# EasyEDA Pro project 主控G4.eprj

# Schematic Schematic1_2
Board Name: Board2功能多样; Create Date: 2025-11-01; Page Name: P1; Project Name: 主控G4; Schematic Name: Schematic1_2; Update Date: 2026-01-25; Company: 嘉立创EDA; Page Size: A4; Version: V1.0
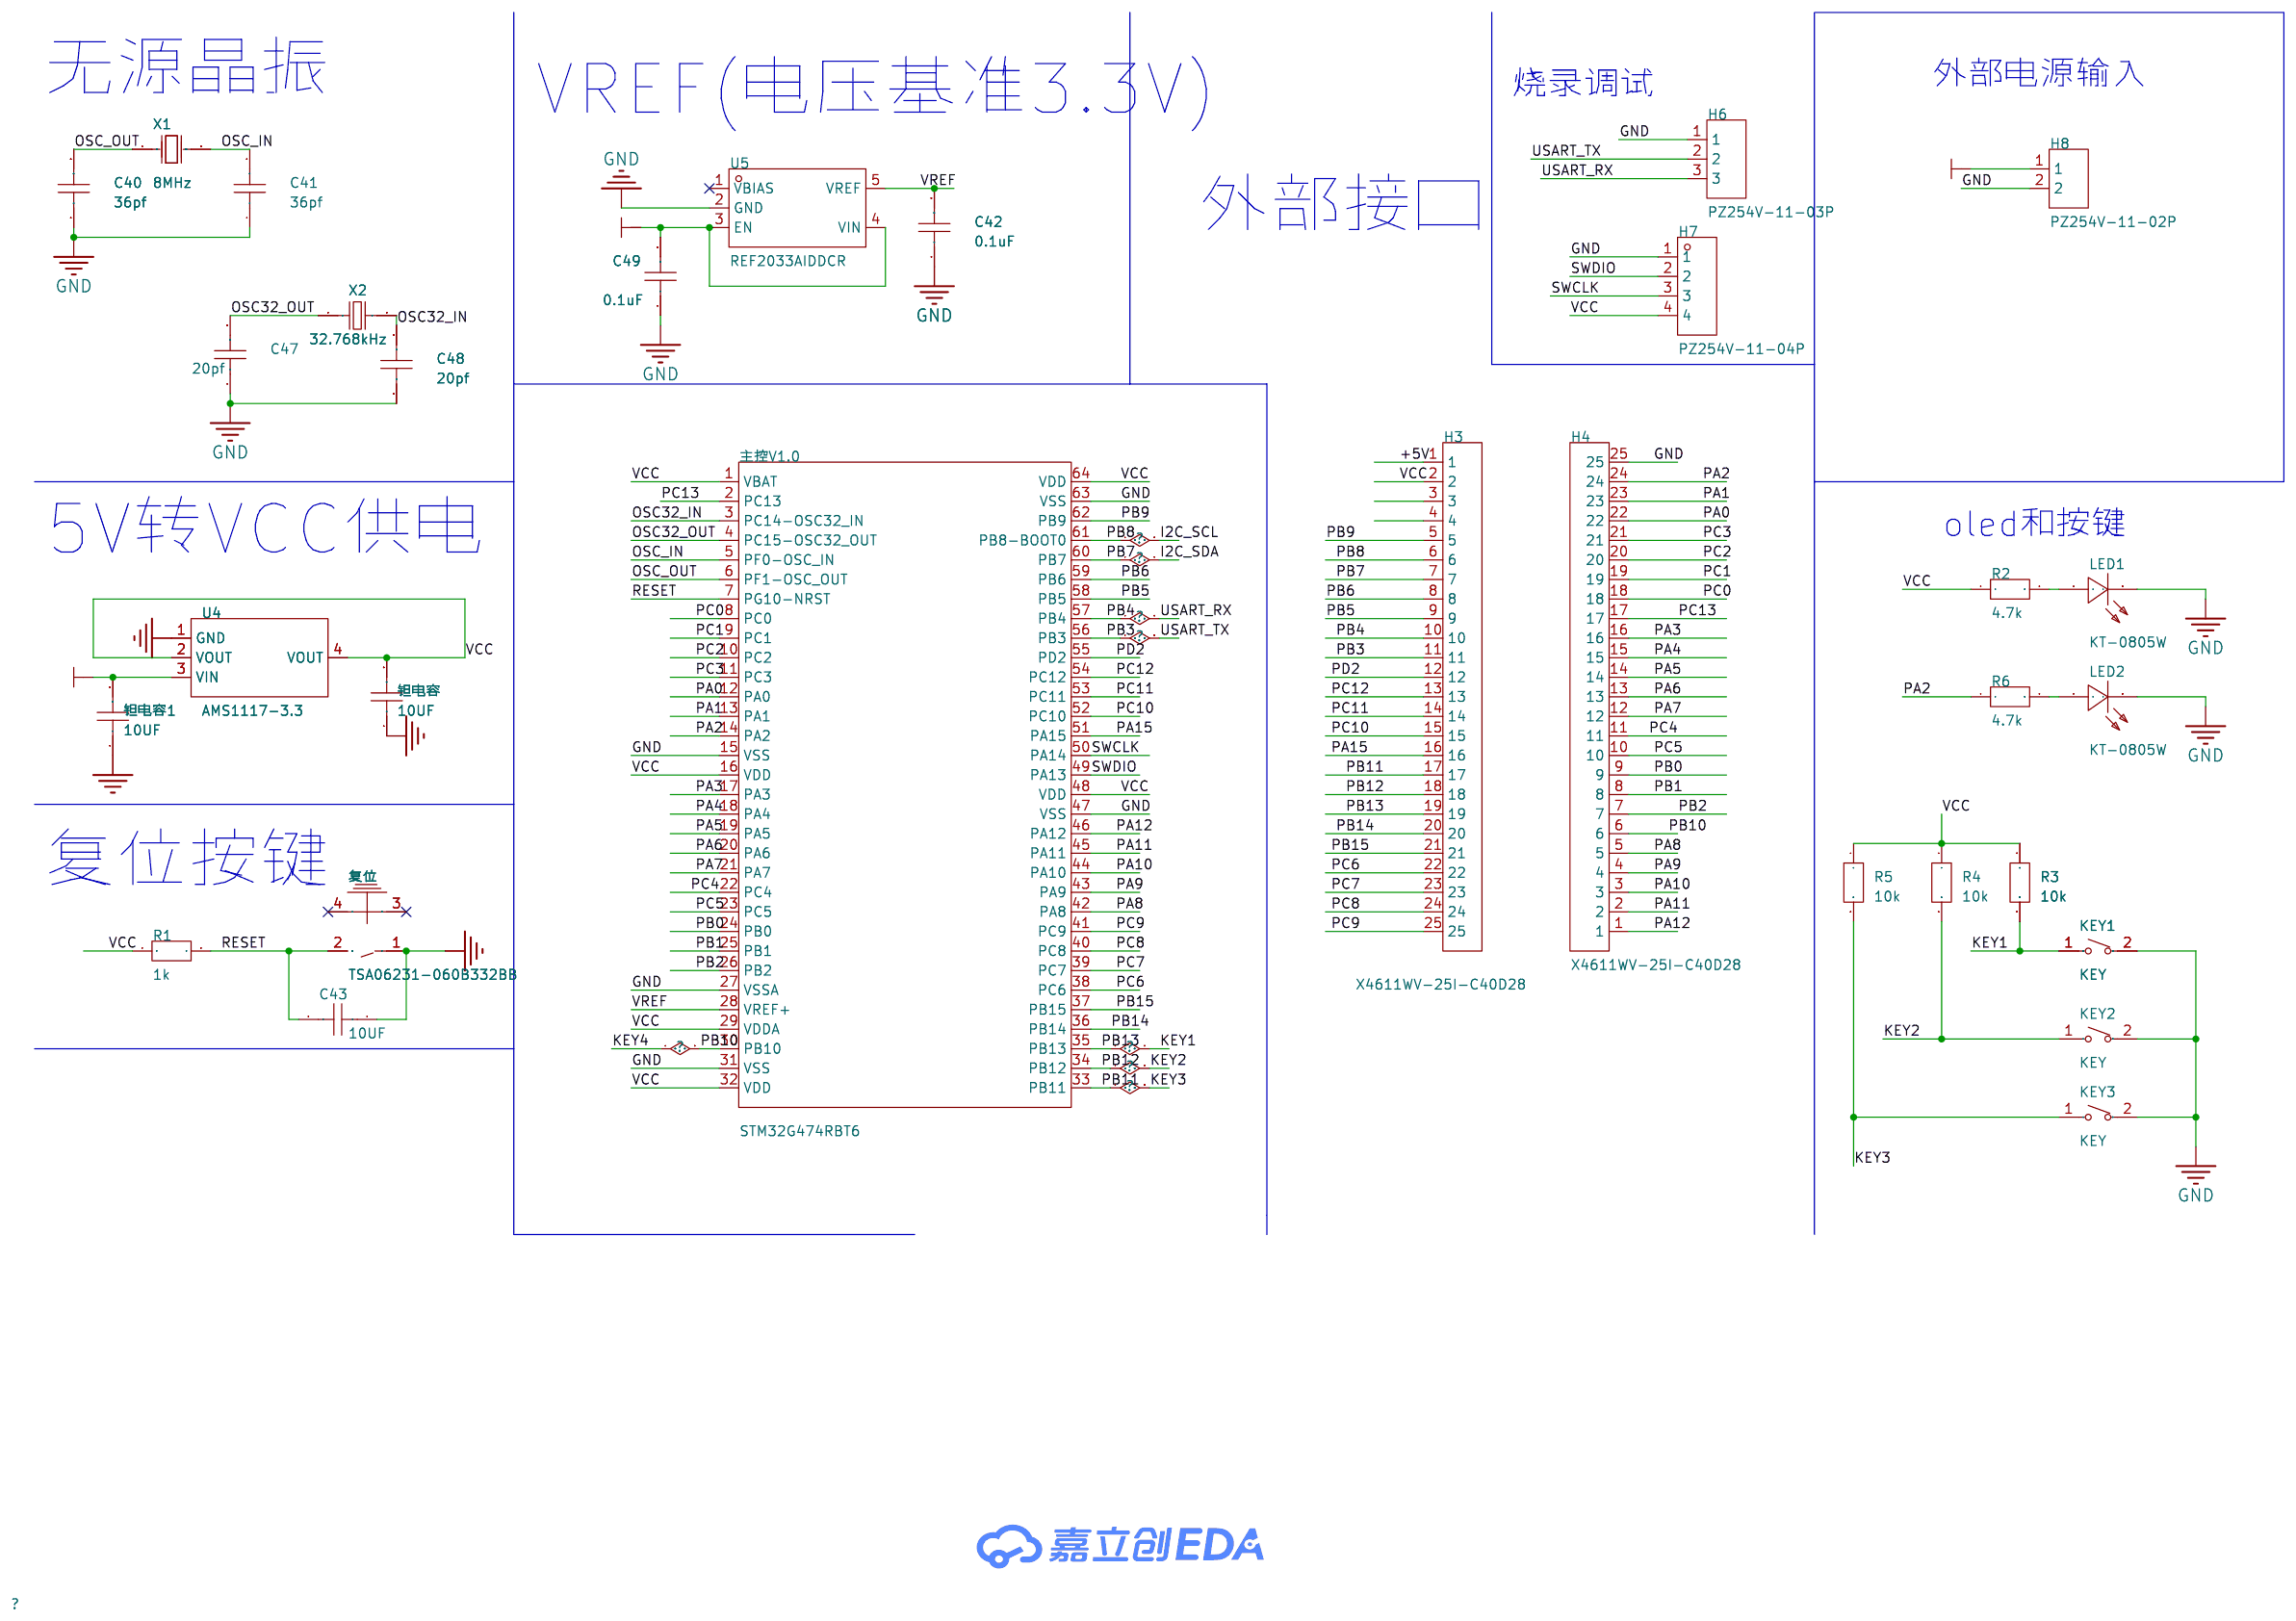
[diagram p0: schematic sheet]

## Parts
C40  36pf  [C0805]
C41  36pf  [C0805]
C42  0.1uF  [C0805]
C43  10UF  [C0805]
C47  20pf  [C0805]
C48  20pf  [C0805]
C49  0.1uF  [C0805]
H3  X4611WV-25I-C40D28  [HDR-TH_25P-P2.00-V-M]
H4  X4611WV-25I-C40D28  [HDR-TH_25P-P2.00-V-M]
H6  PZ254V-11-03P  [HDR-TH_3P-P2.54-V-M]
H7  PZ254V-11-04P  [HDR-TH_4P-P2.54-V-M]
H8  PZ254V-11-02P  [HDR-TH_2P-P2.54-V-M]
KEY1  KEY  [SW-SMD_L6.0-W3.7-LS8.0]
KEY2  KEY  [SW-SMD_L6.0-W3.7-LS8.0]
KEY3  KEY  [SW-SMD_L6.0-W3.7-LS8.0]
LED1  KT-0805W  [LED0805-R-RD]
LED2  KT-0805W  [LED0805-R-RD]
R1  1k  [R0603]
R2  4.7k  [R0805]
R3  10k  [R0805]
R4  10k  [R0805]
R5  10k  [R0805]
R6  4.7k  [R0805]
U4  AMS1117-3.3  [SOT-223-3_L6.5-W3.4-P2.30-LS7.0-BR]
U5  REF2033AIDDCR  [SOT-23-5_L3.0-W1.7-P0.95-LS2.8-BL]
X1  8MHz  [CRYSTAL-SMD_L5.0-W3.2]
X2  32.768kHz  [FC-135R_L3.2-W1.5]
主控V1.0  STM32G474RBT6  [LQFP-64_L10.0-W10.0-P0.50-LS12.0-BL]
复位  TSA06231-060B332BB  [SW-TH_TSA06231-060B332BB]
钽电容  10UF  [C0805]
钽电容1  10UF  [C0805]

## Library data of the parts
C40-C43 C47-C49 钽电容 钽电容1 = CC0805KRX7R9BB104: 容值:100nF;精度:±10%;额定电压:50V;材质(温度系数):X7R;; LCSC Part Name: 100nF ±10% 50V; Supplier Part: C49678; Manufacturer: YAGEO(国巨); Supplier Footprint: 0805; JLCPCB Part Class: 基础库; Datasheet: https://atta.szlcsc.com/upload/public/pdf/source/20180224/C181747_15194369449651363981.pdf; Supplier: LCSC; Tolerance: ±10%; Voltage Rated: 50V; Temperature Coefficient: X7R
H3 H4 = X4611WV-25I-C40D28: 插针结构:1x25P;间距:2mm;行距:2mm;圆针/方针:方针;排数:单排;总PIN位数:25P;额定电流:3A;额定电压:250V;配合针长度:-;塑高:2mm;端接针长度:-;触头材质:黄铜;触头镀层:金;工作温度:-40℃~+105℃;颜色:黑色;; LCSC Part Name: 1x25P 间距:2mm 方针; Supplier Part: C2882999; Manufacturer: XKB Connection(中国星坤); Supplier Footprint: 插件,P=2mm; JLCPCB Part Class: 扩展库; Supplier: LCSC; Pin Structure: 1x25P; Pitch: 2mm; Row Spacing: 2mm; Circluar Pins/Square Pins: 方针; Number of Rows: 单排; Number of Pins: 25P; Current Rating: 3A; Voltage Rating (Max): 250V; Insulation Height: 2mm; Contact Material: 黄铜; Contact Plating: 金; Operating Temperature: -40℃~+105℃; Color: 黑色
H6 = PZ254V-11-03P: LCSC Part Name: 1x3P 间距:2.54mm 方针 直插; Supplier Part: C2937625; Manufacturer: XFCN(兴飞); Supplier Footprint: 插件,P=2.54mm; JLCPCB Part Class: 扩展库; Datasheet: https://item.szlcsc.com/datasheet/PZ254V-11-03P/3293280.html; Supplier: LCSC; Pin Structure: 1x3P; Pitch: 2.54mm; Circluar Pins/Square Pins: 方针; Mounting Type: 直插; Number of Rows: 单排; Number of Pins: 3P; Current Rating: 3A; Voltage Rating (Max): 250V; Length of Mating Pin: 6mm; Insulation Height: 2.5mm; Length of End Connection Pin: 3mm; Operating Temperature: -40℃~+105℃; Color: 黑色
H7 = PZ254V-11-04P: LCSC Part Name: 1x4P 间距:2.54mm 方针 直插; Supplier Part: C2691448; Manufacturer: XFCN(兴飞); Supplier Footprint: 插件,P=2.54mm; JLCPCB Part Class: 扩展库; Datasheet: https://item.szlcsc.com/datasheet/PZ254V-11-04P/2801085.html; Supplier: LCSC; Pin Structure: 1x4P; Pitch: 2.54mm; Circluar Pins/Square Pins: 方针; Mounting Type: 直插; Number of Rows: 单排; Number of Pins: 4P; Current Rating: 3A; Voltage Rating (Max): 250V; Length of Mating Pin: 6mm; Insulation Height: 2.5mm; Length of End Connection Pin: 3mm; Operating Temperature: -40℃~+105℃; Color: 黑色
H8 = PZ254V-11-02P: 插针结构:1x2P;间距:2.54mm;行距:-;圆针/方针:方针;安装方式:直插;排数:单排;总PIN位数:2P;额定电流:-;额定电压:-;配合针长度:6mm;塑高:2.5mm;端接针长度:3mm;触头材质:黄铜;触头镀层:-;工作温度:-40℃~+105℃;颜色:黑色;; LCSC Part Name: 1x2P 间距:2.54mm 方针 直插; Supplier Part: C492401; Manufacturer: XFCN(兴飞); Supplier Footprint: 插件,P=2.54mm; JLCPCB Part Class: 扩展库; Datasheet: https://atta.szlcsc.com/upload/public/pdf/source/20200309/C492401_A812433581A9B211A7FFA413ADDFF0E5.pdf; Supplier: LCSC; Pin Structure: 1x2P; Pitch: 2.54mm; Circluar Pins/Square Pins: 方针; Mounting Type: 直插; Number of Rows: 单排; Number of Pins: 2P; Length of Mating Pin: 6mm; Insulation Height: 2.5mm; Length of End Connection Pin: 3mm; Contact Material: 黄铜; Operating Temperature: -40℃~+105℃; Color: 黑色
KEY1-KEY3 = KEY: Supplier Part: C9900023212; Supplier Footprint: SW-SMD-2P; JLCPCB Part Class: 扩展库; Supplier: LCSC
LED1 LED2 = KT-0805W: LCSC Part Name: 0805 白灯 高亮; Supplier Part: C34499; Manufacturer: KENTO; Supplier Footprint: 0805; JLCPCB Part Class: 基础库; Datasheet: https://atta.szlcsc.com/upload/public/pdf/source/20221124/DAA20402FFC1FB071B8B6797757426FE.pdf; Supplier: LCSC
R1 = CRCW0603348RFKEA: 电阻类型:厚膜电阻;阻值:348Ω;精度:±1%;功率:100mW;温度系数:±100ppm/℃;; LCSC Part Name: 厚膜电阻 348Ω ±1% 100mW; Supplier Part: C4074594; Manufacturer: VISHAY(威世); Supplier Footprint: 0603; JLCPCB Part Class: 扩展库; Datasheet: https://item.szlcsc.com/datasheet/CRCW0603348RFKEA/4643861.html; Supplier: LCSC; Type: 厚膜电阻; Tolerance: ±1%; Power(Watts): 100mW; Temperature Coefficient: ±100ppm/℃; Operating Temperature: -55℃~+155℃
R2-R6 = CRCW080510K0FKEB: LCSC Part Name: 停产 厚膜电阻 10kΩ ±1% 125mW; Supplier Part: C844194; Manufacturer: VISHAY(威世); Supplier Footprint: 0805; JLCPCB Part Class: 扩展库; Datasheet: https://atta.szlcsc.com/upload/public/pdf/source/20231213/E27ADD8137C82CFD375B974C2A3DE022.pdf; Supplier: LCSC; Type: 厚膜电阻; Tolerance: ±1%; Power(Watts): 125mW; Temperature Coefficient: ±100ppm/℃; Operating Temperature: -55℃~+155℃
U4 = AMS1117-3.3_C6186: 输出类型:固定;工作电压:-;输出电压:3.3V;输出电流:1A;电源纹波抑制比(PSRR):72dB@(120Hz);输出极性:正极;; LCSC Part Name: 输出3.3V 1A; Supplier Part: C6186; Manufacturer: AMS; Supplier Footprint: SOT-223; JLCPCB Part Class: 基础库; Datasheet: https://atta.szlcsc.com/upload/public/pdf/source/20180727/C6186_7A095716F0823C02F1997A905E26C086.pdf; Supplier: LCSC; Output Type: 固定; Output Voltage: 3.3V; Output Current: 1A; Power Supply Rejection Ratio (PSRR): 72dB@(120Hz); Voltage Dropout: 1.3V@(800mA); Features: 过流保护(OCP)；热保护(TSD); Output Configuration: 正极; Number of Outputs: 1
U5 = REF2033AIDDCR: 输出类型:固定;工作电压:3.32V~5.5V;输出电压:3.3V;输出电流:20mA;精度:±0.05%;; LCSC Part Name: 双输出参考电压源，适用于单电源系统; Supplier Part: C440747; Manufacturer: TI(德州仪器); Supplier Footprint: SOT-23-5; JLCPCB Part Class: 扩展库; Datasheet: https://www.ti.com/cn/lit/gpn/ref2033; Supplier: LCSC; Output Type: 固定; Voltage - Supply: 3.32V~5.5V; Output Voltage: 3.3V; Output Current: 20mA; Tolerance: ±0.05%; Temperature Coefficient: 8ppm/℃; Reference Type: 串联; Operating Temperature: -40℃~+125℃
X1 = X50328MSB2GI: 晶振类型:贴片晶振;频率:8MHz;常温频差:±10ppm;负载电容:20pF;频率稳定度:±20ppm;; LCSC Part Name: 8MHz ±10ppm 20pF; Supplier Part: C115962; Manufacturer: YXC(扬兴晶振); Supplier Footprint: SMD5032; JLCPCB Part Class: 基础库; Datasheet: https://atta.szlcsc.com/upload/public/pdf/source/20240329/44922B0AF7B60E58E9B66993B6077277.pdf; Supplier: LCSC; Type: 贴片晶振; Normal temperature Frequency Tolerance: ±10ppm; Load Capacitance: 20pF; Frequency Stability: ±20ppm; Operating Temperature: -40℃~+85℃
X2 = Q13FC1350000400: 晶振类型:贴片无源晶振;频率:32.768kHz;频率公差:±20ppm;频率稳定度:-;负载电容:12.5pF;等效串联电阻(ESR):70kΩ;工作温度:-40~+85;; LCSC Part Name: 32.768kHz ±20ppm 12.5pF; Supplier Part: C32346; Manufacturer: EPSON(爱普生); Supplier Footprint: SMD3215-2P; JLCPCB Part Class: Basic Part; Datasheet: https://atta.szlcsc.com/upload/public/pdf/source/20190108/C32346_746D6B07EAF90824457A96480007685F.pdf; Supplier: LCSC; Crystal Type: 贴片无源晶振; Frequency Tolerance: ±20ppm; Load Capacitance: 12.5pF; Equivalent Series Resistance (ESR): 70kΩ; Operating Temperature: -40~+85
主控V1.0 = STM32G474RBT6: CPU内核:ARM-M4;CPU最大主频:170MHz;应用领域:-;; LCSC Part Name: 带DSP和FPU的170MHz主流ARM Cortex-M4 MCU，具有128 KB Flash存储器、数学加速器、高分辨率定时器和高模拟电平集成; Supplier Part: C529413; Manufacturer: ST(意法半导体); Supplier Footprint: LQFP-64(10x10); JLCPCB Part Class: 扩展库; Datasheet: https://item.szlcsc.com/datasheet/STM32G474RBT6/549641.html; Supplier: LCSC; CPU Core: ARM-M4; CPU Maximum Speed: 170MHz; Program Storage Size: 128KB; Program Memory Type: FLASH; Number of I/O: 52; ADC (Bit): 12bit; DAC (Bit): 12bit; Voltage - Supply: 1.71V~3.6V
复位 = TSA06231-060B332BB: 卧式插式、3.2座、180gf不锈钢、Fe缺口支架、PA66红柄; LCSC Part Name: 轻触开关; Supplier Part: C42435078; Manufacturer: Khon(康宏电子); Supplier Footprint: 弯插-4P,7.4x6.2mm; Datasheet: https://atta.szlcsc.com/upload/public/pdf/source/20250107/79642270F222B0186377B45340056112.pdf; Supplier: LCSC

## Nets
+5V: C49.2 H3.1 H8.1 U4.3(VIN) U5.3(EN) U5.4(VIN) 钽电容1.2
GND: C40.1 C41.1 C42.1 C43.1 C47.1 C48.1 C49.1 H4.25 H6.1 H7.1 H8.2 KEY1.2 KEY2.2 KEY3.2 LED1.2(K) LED2.2(K) U4.1(GND) U5.2(GND) 主控V1.0.15(VSS) 主控V1.0.27(VSSA) 主控V1.0.31(VSS) 主控V1.0.47(VSS) 主控V1.0.63(VSS) 复位.1 钽电容.1 钽电容1.1
VCC: H3.2 H7.4 R1.1 R2.1 R3.1 R4.1 R5.1 U4.2(VOUT) U4.4(VOUT) 主控V1.0.1(VBAT) 主控V1.0.16(VDD) 主控V1.0.29(VDDA) 主控V1.0.32(VDD) 主控V1.0.48(VDD) 主控V1.0.64(VDD) 钽电容.2
I2C_SCL: H3.6 主控V1.0.61(PB8-BOOT0)
I2C_SDA: H3.7 主控V1.0.60(PB7)
KEY1: H3.19 KEY1.1 R3.2 主控V1.0.35(PB13)
KEY2: H3.18 KEY2.1 R4.2 主控V1.0.34(PB12)
KEY3: H3.17 KEY3.1 R5.2 主控V1.0.33(PB11)
KEY4: H4.6 主控V1.0.30(PB10)
OSC32_IN: C48.2 X2.2 主控V1.0.3(PC14-OSC32_IN)
OSC32_OUT: C47.2 X2.1 主控V1.0.4(PC15-OSC32_OUT)
OSC_IN: C41.2 X1.2(OSC2) 主控V1.0.5(PF0-OSC_IN)
OSC_OUT: C40.2 X1.1(OSC1) 主控V1.0.6(PF1-OSC_OUT)
PA0: H4.22 主控V1.0.12(PA0)
PA1: H4.23 主控V1.0.13(PA1)
PA2: H4.24 R6.1 主控V1.0.14(PA2)
PA3: H4.16 主控V1.0.17(PA3)
PA4: H4.15 主控V1.0.18(PA4)
PA5: H4.14 主控V1.0.19(PA5)
PA6: H4.13 主控V1.0.20(PA6)
PA7: H4.12 主控V1.0.21(PA7)
PA8: H4.5 主控V1.0.42(PA8)
PA9: H4.4 主控V1.0.43(PA9)
PA10: H4.3 主控V1.0.44(PA10)
PA11: H4.2 主控V1.0.45(PA11)
PA12: H4.1 主控V1.0.46(PA12)
PA15: H3.16 主控V1.0.51(PA15)
PB0: H4.9 主控V1.0.24(PB0)
PB1: H4.8 主控V1.0.25(PB1)
PB2: H4.7 主控V1.0.26(PB2)
PB3: H3.11 H6.2 主控V1.0.56(PB3)
PB4: H3.10 H6.3 主控V1.0.57(PB4)
PB5: H3.9 主控V1.0.58(PB5)
PB6: H3.8 主控V1.0.59(PB6)
PB9: H3.5 主控V1.0.62(PB9)
PB14: H3.20 主控V1.0.36(PB14)
PB15: H3.21 主控V1.0.37(PB15)
PC0: H4.18 主控V1.0.8(PC0)
PC1: H4.19 主控V1.0.9(PC1)
PC2: H4.20 主控V1.0.10(PC2)
PC3: H4.21 主控V1.0.11(PC3)
PC4: H4.11 主控V1.0.22(PC4)
PC5: H4.10 主控V1.0.23(PC5)
PC6: H3.22 主控V1.0.38(PC6)
PC7: H3.23 主控V1.0.39(PC7)
PC8: H3.24 主控V1.0.40(PC8)
PC9: H3.25 主控V1.0.41(PC9)
PC10: H3.15 主控V1.0.52(PC10)
PC11: H3.14 主控V1.0.53(PC11)
PC12: H3.13 主控V1.0.54(PC12)
PC13: H4.17 主控V1.0.2(PC13)
PD2: H3.12 主控V1.0.55(PD2)
RESET: C43.2 R1.2 主控V1.0.7(PG10-NRST) 复位.2
SWCLK: H7.3 主控V1.0.50(PA14)
SWDIO: H7.2 主控V1.0.49(PA13)
VREF: C42.2 U5.5(VREF) 主控V1.0.28(VREF+)
$1N19272: LED1.1(A) R2.2
$1N19808: LED2.1(A) R6.2

Not connected (* = marked no-connect by the designer): H3 3 4; U5 1(VBIAS)*; 复位 3* 4*

## Notes on the sheet
- 外部电源输入
- 无源晶振
- 烧录调试
- VREF(电压基准3.3V)
- 外部接口
- oled和按键
- 5V转VCC供电
- 复位按键

# Board PCB1_2
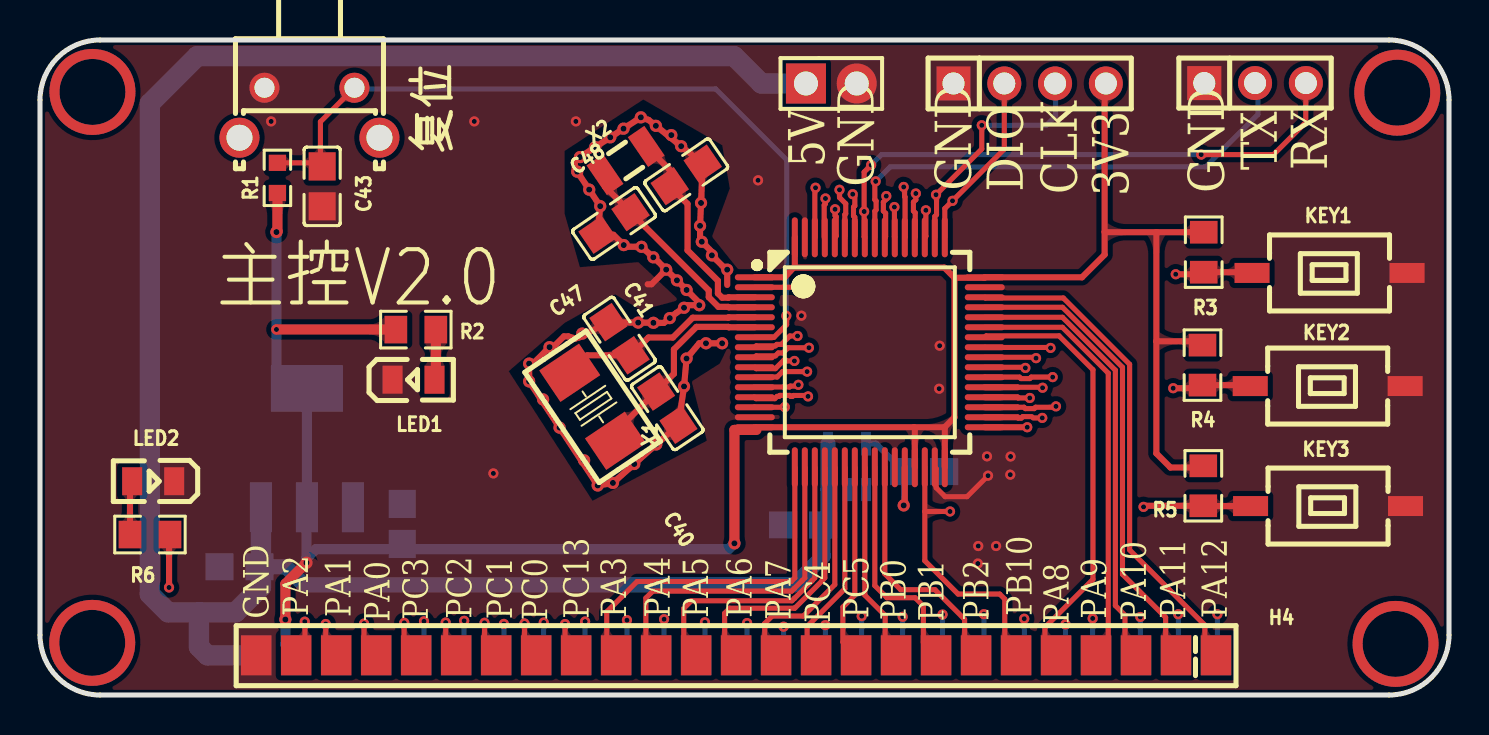
[diagram p1: board, top side]
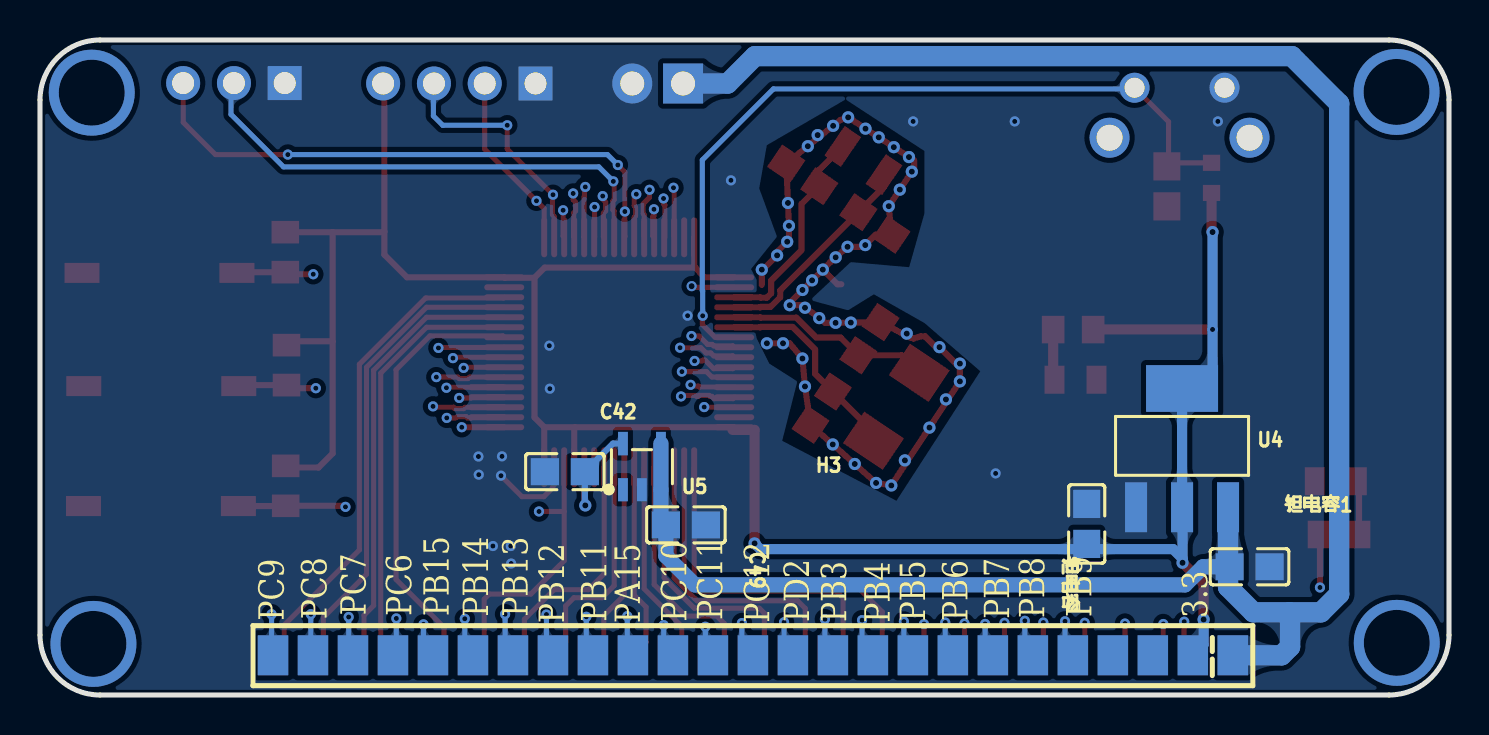
[diagram p2: board, bottom side, seen from below]

Outline 70.46 x 32.77 mm; copper layers: Top Layer, Inner1, Inner2, Bottom Layer. Coordinates in mm from the lower left corner of the outline.
Outline path: 0,29.77 0,3 arc(0.88,0.88) 3,0 67.46,0 arc(69.59,0.88) 70.46,3 70.46,29.77 arc(69.59,31.89) 67.46,32.77 3,32.77 arc(0.88,31.89) 0,29.77
Stack: Top Layer 0.035mm 外层铜厚1oz / Dielectric1 0.2104mm 7628 RC49% 8.6mil / Inner1 0.0152mm 内层铜厚 / Dielectric2 1.065mm 1.1mm H/HOZ Copper / Inner2 0.0152mm 内层铜厚 / Dielectric3 0.2104mm 7628 RC49% 8.6mil / Bottom Layer 0.035mm 外层铜厚1oz

## Design rules (mm)
net OSC_OUT: DP1
net OSC_IN: DP1
net OSC32_OUT: DP2
net OSC32_IN: DP2
template: 自定义配置
spacing copperThickness1oz (default): track to track 0.102, other pairs 0.152 to 0.3
spacing copperThickness2oz: track to track 0.203, other pairs 0.152 to 0.3
track width copperThickness1oz (default): min 0.127, default 0.254, max 2.54
track width copperThickness2oz: min 0.203, default 0.254, max 2.54
differential pair differentialPair (default): width min 0.127, default 0.254, max 2.54; gap min 0.152, default 0.152
via viaSize (default): diameter min 0.5, default 0.508, max 5.08; hole min 0.025, default 0.254, max 4

## Placement (name value [footprint] x y rotation side)
C40  36pf  [C0805]  31.37 14.35 124 top
C41  36pf  [C0805]  28.98 17.82 304 top
C42  0.1uF  [C0805]  44.21 11.17 180 bottom
C43  10UF  [C0805]  14.11 25.44 90 top
C47  20pf  [C0805]  28.71 23.59 34.4 top
C48  20pf  [C0805]  32.32 26.02 214.4 top
C49  0.1uF  [C0805]  38.16 8.51 0 bottom
H3  X4611WV-25I-C40D28  [HDR-TH_25P-P2.00-V-M#2]  34.81 1.99 0 bottom
H4  X4611WV-25I-C40D28  [HDR-TH_25P-P2.00-V-M]  34.65 1.54 180 top
H6  PZ254V-11-03P  [HDR-TH_3P-P2.54-V-M]  60.77 30.61 0 top
H7  PZ254V-11-04P  [HDR-TH_4P-P2.54-V-M]  49.49 30.59 0 top
H8  PZ254V-11-02P  [HDR-TH_2P-P2.54-V-M]  39.57 30.59 0 top
KEY1  KEY  [SW-SMD_L6.0-W3.7-LS8.0]  64.49 21.11 0 top
KEY2  KEY  [SW-SMD_L6.0-W3.7-LS8.0]  64.4 15.45 0 top
KEY3  KEY  [SW-SMD_L6.0-W3.7-LS8.0]  64.42 9.45 0 top
LED1  KT-0805W  [LED0805-R-RD]  18.68 15.77 0 top
LED2  KT-0805W  [LED0805-R-RD]  5.66 10.69 180 top
R1  1k  [R0603]  11.87 25.87 90 top
R2  4.7k  [R0805]  18.8 18.28 0 top
R3  10k  [R0805]  58.2 22.15 270 top
R4  10k  [R0805]  58.14 16.5 270 top
R5  10k  [R0805]  58.18 10.47 270 top
R6  4.7k  [R0805]  5.5 8.03 180 top
U4  AMS1117-3.3  [SOT-223-3_L6.5-W3.4-P2.30-LS7.0-BR]  13.35 12.36 270 bottom
U5  REF2033AIDDCR  [SOT-23-5_L3.0-W1.7-P0.95-LS2.8-BL]  40.36 11.42 180 bottom
X1  8MHz  [CRYSTAL-SMD_L5.0-W3.2]  27.64 14.42 124 top
X2  32.768kHz  [FC-135R_L3.2-W1.5]  29.29 26.74 34.4 top
主控V1.0  STM32G474RBT6  [LQFP-64_L10.0-W10.0-P0.50-LS12.0-BL]  41.5 17.14 270 top
复位  TSA06231-060B332BB  [SW-TH_TSA06231-060B332BB]  13.48 29.13 0 top
钽电容  10UF  [C0805]  18.12 8.56 270 bottom
钽电容1  10UF  [C0805]  9.98 6.41 0 bottom

## Footprints (pads in the part's own frame, mm; a bottom-side part is the same pattern mirrored in y, then rotated)
C0805
  rect 1.41x1.35 smd: 1(-1,0) 2(1,0)
CRYSTAL-SMD_L5.0-W3.2
  rect 1.9x2.4 smd: 1(-2.05,0) 2(2.05,0)
FC-135R_L3.2-W1.5
  rect 1.001x1.801 smd: 1(-1.25,0) 2(1.25,0)
HDR-TH_2P-P2.54-V-M
  rect 2x2 hole 1.2: 1(-1.27,0)
  round 2 hole 1.2: 2(1.27,0)
HDR-TH_3P-P2.54-V-M
  rect 1.7x1.7 hole 1.1: 1(-2.54,0)
  round 1.7 hole 1.1: 2(0,0) 3(2.54,0)
HDR-TH_4P-P2.54-V-M
  rect 1.7x1.7 hole 1.1: 1(-3.81,0)
  round 1.7 hole 1.1: 2(-1.27,0) 3(1.27,0) 4(3.81,0)
HDR-TH_25P-P2.00-V-M
  rect 1.524x2 smd: 1(-24.165,-0.445) 2(-22.165,-0.445) 3(-20.165,-0.445) 4(-18.165,-0.445) 5(-16.165,-0.445) 6(-14.165,-0.445) 7(-12.165,-0.445) 8(-10.165,-0.445) 9(-8.165,-0.445) 10(-6.165,-0.445) 11(-4.165,-0.445) 12(-2.165,-0.445) 13(-0.165,-0.445) 14(1.835,-0.445) 15(3.835,-0.445) 16(5.835,-0.445) 17(7.835,-0.445) 18(9.835,-0.445) 19(11.835,-0.445) 20(13.835,-0.445) 21(15.835,-0.445) 22(17.835,-0.445) 23(19.835,-0.445) 24(21.835,-0.445) 25(23.835,-0.445)
HDR-TH_25P-P2.00-V-M#2
  rect 1.524x2 smd: 1(-24,0) 2(-22,0) 3(-20,0) 4(-18,0) 5(-16,0) 6(-14,0) 7(-12,0) 8(-10,0) 9(-8,0) 10(-6,0) 11(-4,0) 12(-2,0) 13(0,0) 14(2,0) 15(4,0) 16(6,0) 17(8,0) 18(10,0) 19(12,0) 20(14,0) 21(16,0) 22(18,0) 23(20,0) 24(22,0) 25(24,0)
LED0805-R-RD
  rect 1x1.399 smd: 1(1.05,0) 2(-1.05,0)
LQFP-64_L10.0-W10.0-P0.50-LS12.0-BL
  oval 0.3x2 smd: 1(-3.75,-5.75) 2(-3.25,-5.75) 3(-2.75,-5.75) 4(-2.25,-5.75) 5(-1.75,-5.75) 6(-1.25,-5.75) 7(-0.75,-5.75) 8(-0.25,-5.75) 9(0.25,-5.75) 10(0.75,-5.75) 11(1.25,-5.75) 12(1.75,-5.75) 13(2.25,-5.75) 14(2.75,-5.75) 15(3.25,-5.75) 16(3.75,-5.75) 33(3.75,5.75) 34(3.25,5.75) 35(2.75,5.75) 36(2.25,5.75) 37(1.75,5.75) 38(1.25,5.75) 39(0.75,5.75) 40(0.25,5.75) 41(-0.25,5.75) 42(-0.75,5.75) 43(-1.25,5.75) 44(-1.75,5.75) 45(-2.25,5.75) 46(-2.75,5.75) 47(-3.25,5.75) 48(-3.75,5.75)
  oval 2x0.3 smd: 17(5.75,-3.75) 18(5.75,-3.25) 19(5.75,-2.75) 20(5.75,-2.25) 21(5.75,-1.75) 22(5.75,-1.25) 23(5.75,-0.75) 24(5.75,-0.25) 25(5.75,0.25) 26(5.75,0.75) 27(5.75,1.25) 28(5.75,1.75) 29(5.75,2.25) 30(5.75,2.75) 31(5.75,3.25) 32(5.75,3.75) 49(-5.75,3.75) 50(-5.75,3.25) 51(-5.75,2.75) 52(-5.75,2.25) 53(-5.75,1.75) 54(-5.75,1.25) 55(-5.75,0.75) 56(-5.75,0.25) 57(-5.75,-0.25) 58(-5.75,-0.75) 59(-5.75,-1.25) 60(-5.75,-1.75) 61(-5.75,-2.25) 62(-5.75,-2.75) 63(-5.75,-3.25) 64(-5.75,-3.75)
R0603
  rect 0.806x0.864 smd: 1(-0.753,0) 2(0.753,0)
R0805
  rect 1.133x1.377 smd: 1(-1,0) 2(1,0)
SOT-23-5_L3.0-W1.7-P0.95-LS2.8-BL
  rect 0.49x1.157 smd: 1(-0.95,-1.153) 2(0,-1.153) 3(0.95,-1.153)
  rect 0.49x1.175 smd: 4(0.95,1.153) 5(-0.95,1.153)
SOT-223-3_L6.5-W3.4-P2.30-LS7.0-BR
  rect 2.5x1.1 smd: 1(2.97,-2.3) 2(2.97,0) 3(2.97,2.3)
  rect 2.34x3.6 smd: 4(-2.97,0)
SW-SMD_L6.0-W3.7-LS8.0
  rect 1.75x1 smd: 1(-3.875,0) 2(3.875,0)
SW-TH_TSA06231-060B332BB
  round 1.5 hole 1: 1(-2.25,1.25) 2(2.25,1.25)
  round 2 hole 1.3: 3(-3.5,-1.25) 4(3.5,-1.25)

## Nets
As in the schematic.

Pads without a net: U5 1; 复位 3 4

## Via types
v1: diameter 4.3, hole 3.3, Top Layer to Bottom Layer, 4 vias
v2: diameter 0.61, hole 0.305, Top Layer to Bottom Layer, 47 vias
v3: diameter 0.508, hole 0.254, Top Layer to Bottom Layer, 84 vias
v4: diameter 0.508, hole 0.305, Top Layer to Bottom Layer, 1 via

## Routing (per net, layer and track width the routed paths; a pad name or vN(x,y) marks a point on that pad's centre or on a via; arc(x,y) is an arc through that point)
+5V: length 109
  Bottom Layer w0.762: 11.05,6.41 12.3,6.41 13.2,5.51 37.72,5.51 39.16,6.95 C49.2 39.41,8.76 U5.3 U5.4
  Bottom Layer w1.016: U4.3 11.05,6.41 ; 11.05,6.41 11.05,5.4 9.79,4.14 7.98,4.14 ; 11.05,6.41 钽电容1.2 ; H8.1 36.07,30.59 34.71,31.96 7.86,31.96 5.49,29.59 5.49,5.05 6.4,4.14 7.98,4.14 ; 7.98,4.14 7.95,4.11 7.95,2.41 8.37,1.99 H3.1
GND: length 58
  Top Layer w0.254: v3(47.41,10.97) 46.36,9.92 45.26,9.92 44.82,10.37 44.82,11.32 主控V1.0.31
  Top Layer w0.305: 34.37,20.52 v2(34.37,21.28) 34.32,21.28 v2(33.6,21.99) 33.6,22.17 v2(33.1,22.67) 33.01,22.76 v2(33.01,23.47) v2(33.06,24.61) C48.1 v2(32.06,27.45) v2(30.8,28.47) 30.43,28.77 v2(30.05,28.9) v2(29.18,28.33) v2(28.52,27.9) v2(27.76,27.4) v2(27.01,26.91) 26.75,26.74 26.75,26.36 v2(27.46,25.28) v2(28.02,24.45) C47.1 28.68,23.02 v2(29.19,22.51) 29.28,22.42 v2(30.08,22.42) v2(30.67,21.89) 30.94,21.66 v2(31.32,21.28) ; 30.39,20.55 30.58,20.55 v2(31.32,21.28) ; v2(31.32,21.28) v2(31.85,20.74) v2(32.33,20.26) 32.97,19.63 v2(32.97,19.5) 32.33,19.5 v2(32.21,19.37) 31.83,19.12 v2(31.5,18.85) 31.19,18.61 v2(30.68,18.62) v2(29.92,18.63) 28.42,18.65 26.95,17.88 arc(26.86,17.87) 26.79,17.83 26.42,17.94 26.2,17.94 25.66,17.4 v2(25.48,17.4) 24.66,16.58 v2(24.46,16.58) v2(24.46,15.69) v2(25.98,13.38) v2(27.89,10.48) v2(28.65,10.61) v2(29.72,11.56) v2(30.82,12.53) C40.1 v2(32.21,15.44) v2(32.33,16.83) 32.97,17.59 v2(33.31,17.59) v2(34.11,17.59)
  vias: v2(25.16,14.79) v2(26.86,26.18) v2(27.12,18.08) v2(27.21,11.74) v2(31.57,28.01) v3(11.56,28.69) v3(21.72,28.69) v3(22.67,11.09) v3(26.8,28.69) v3(35.91,25.75) v3(38.08,18.97) v3(44.99,17.47) v3(44.97,15.32) v3(46.92,7.45) v3(46.9,6.58) v3(47.36,11.94) v3(47.81,7.45) v3(48.54,11.93) v3(48.52,11.02)
VCC: length 130.1
  Top Layer w0.305: 45.24,13.39 43.71,13.39 ; 45.24,13.39 45.25,13.39 主控V1.0.32 ; 45.24,13.39 45.73,13.89 45.73,20.87 ; 43.71,13.39 43.75,13.35 主控V1.0.29 ; 43.71,13.39 主控V1.0.16 ; 58.14,17.65 58.09,17.7 55.83,17.7 ; 45.73,20.87 45.23,21.38 37.69,21.38 ; 45.73,20.87 47.23,20.87 主控V1.0.48 52.11,20.89 53.24,22.03 53.24,23.17 ; 53.24,23.17 53.24,30.53 H7.4 ; 53.24,23.17 53.26,23.15 55.83,23.15 ; 55.83,17.7 55.83,12.09 56.53,11.38 58.09,11.38 R5.1 ; 55.83,17.7 55.83,23.15 ; 37.71,21.4 37.68,21.38 ; 37.71,21.4 37.75,21.44 主控V1.0.64 ; 37.71,21.4 37.69,21.38 ; 37.69,21.38 37.25,20.89 主控V1.0.1 ; 55.83,23.15 R3.1
  Top Layer w0.508: 17.43,18.3 17.41,18.29 v3(11.82,18.29) ; R1.1 11.87,23.21 v2(11.82,23.16) ; v2(12.27,3.78) 12.27,5.56 v2(13.33,6.61) ; 35.83,13.26 34.73,13.26 v2(34.73,7.59)
  Bottom Layer w0.508: 13.45,8.66 13.33,8.54 13.33,6.82 ; v2(11.82,23.16) v3(11.82,18.29) 11.82,15.84 12.33,15.33 U4.4 U4.2 13.35,8.56 ; v2(12.27,3.78) 12.27,2.53 H3.2 ; v2(34.73,7.59) 34.44,7.3 13.8,7.3 13.33,6.82 ; 13.33,6.82 v2(13.33,6.61)
(no net):
  vias: v1(2.62,30.17) v1(2.61,2.61) v1(67.79,2.56) v1(67.88,30.13)
I2C_SCL: length 39.4
  Top Layer w0.254: v3(39.28,24.84) 39.28,24.57 39.22,24.51 39.22,22.89
  Inner2 w0.254: v3(21.21,3.71) 21.21,5.95 24.25,8.99 35.88,8.99 39.28,12.4 39.28,14.55 39.34,14.62 39.34,17.74 39.28,17.8 39.28,24.02 39.23,24.08 39.23,24.52 39.28,24.57 v3(39.28,24.84)
  Bottom Layer w0.254: v3(21.21,3.71) 21.21,2.39 H3.6
I2C_SDA: length 35.9
  Top Layer w0.254: 主控V1.0.60 39.82,22.97 39.82,23.92 39.76,23.98 v3(39.76,24.3)
  Inner2 w0.254: v3(23.2,3.56) 23.2,4.38 27.45,8.63 36.2,8.63 39.76,12.2 v3(39.76,24.3)
  Bottom Layer w0.254: v3(23.2,3.56) 23.2,2.37 H3.7
KEY1: length 34
  Top Layer w0.254: v3(50.81,14.44) 50.77,14.39 49.79,14.39 49.72,14.33 49.28,14.33 49.21,14.39 48.88,14.39
  Top Layer w0.305: KEY1.1 60.58,21.15 R3.2 58.09,21.05 v3(56.8,21.05) ; 48.88,14.39 主控V1.0.35
  Inner1 w0.305: v3(56.8,21.05) 50.81,15.06 v3(50.81,14.44)
  Inner2 w0.254: v3(47.2,4.04) 47.78,4.62 50.04,4.62 51.18,5.76 51.18,11.19 52.51,12.53 52.51,13.65 51.72,14.44 v3(50.81,14.44)
  Bottom Layer w0.254: H3.19 47.2,2.38 v3(47.2,4.04)
KEY2: length 32.5
  Top Layer w0.254: v3(50.12,13.86) 49.66,13.86 ; 48.88,13.89 48.92,13.85 49.08,13.85 49.15,13.93 49.59,13.93
  Top Layer w0.305: KEY2.1 60.47,15.5 R4.2 57.98,15.35 v3(56.67,15.35) ; 48.88,13.89 主控V1.0.34
  Inner1 w0.305: v3(56.67,15.35) 55.31,15.35 53.83,13.86 v3(50.12,13.86)
  Inner2 w0.254: v3(50.12,13.86) 51.47,13.86 51.93,13.41 51.93,12.77 50.6,11.44 50.6,5.87 50.49,5.77 50.49,5.73 50.1,5.34 50.06,5.34 49.98,5.25 46.36,5.25 v3(45.14,4.03)
  Bottom Layer w0.254: v3(45.14,4.03) 45.14,2.31 H3.18
KEY3: length 34.8
  Top Layer w0.305: v3(49.37,13.39) 主控V1.0.33 ; KEY3.1 58.19,9.45 R5.2 55.24,9.47 v3(55.19,9.41)
  Inner1 w0.305: v3(49.37,13.39) 49.37,9.85 49.74,9.48 55.12,9.48 v3(55.19,9.41)
  Inner2 w0.254: 49.37,13.32 49.4,13.36 49.71,13.36 49.97,13.1 49.97,5.7 46.31,5.7 46.09,5.48 44.75,5.48 43.19,3.91 v3(43.14,3.91)
  Bottom Layer w0.254: v3(43.14,3.91) 43.14,2.32 H3.17
KEY4: length 13.8
  Top Layer w0.254: H4.6 48.25,2.55 48.25,4.8 47.99,5.05 45.91,5.05 44.25,6.72 44.25,9.18 ; 44.25,9.18 v3(45.51,9.18) ; 44.25,9.18 主控V1.0.30
OSC32_IN: length 10.8
  Top Layer w0.305: 主控V1.0.3 34.44,19.89 34.42,19.87 34.12,19.87 33.9,20.09 33.9,20.73 32.38,22.24 32.38,24.56 31.49,25.45 31.49,26.27 30.32,27.44
OSC32_OUT: length 10.8
  Top Layer w0.305: 28.26,26.03 28.26,25.43 C47.2 33.44,20.24 33.44,19.9 33.93,19.42 34.42,19.42 34.44,19.39 主控V1.0.4
OSC_IN: length 10.4
  Top Layer w0.305: X1.2 27.36,16.99 C41.2 30.43,17.88 31.65,17.88 32.64,18.87 34.42,18.87 34.44,18.89 主控V1.0.5
OSC_OUT: length 10.3
  Top Layer w0.305: X1.1 28.91,12.85 28.91,13.28 31.7,16.07 31.7,17.29 32.83,18.42 34.42,18.42 34.44,18.39 主控V1.0.6
PA0: length 35.4
  Top Layer w0.254: 35.72,15.41 37.48,15.41 37.53,15.45 37.86,15.45 v3(37.93,15.52) ; v3(16.2,3.57) 16.2,2.59 H4.22
  Inner1 w0.254: v3(16.2,3.57) 19.15,6.52 22.63,6.52 24.83,8.72 31.26,8.72 35.38,12.84 39.11,12.84 39.87,13.6 39.87,14.68 38.86,15.69 38.63,15.69 38.45,15.52 v3(37.93,15.52)
PA1: length 36.7
  Top Layer w0.254: v3(14.29,3.55) 14.29,2.51 H4.23 ; v3(38.41,14.94) 38.36,14.98 37.67,14.98 37.63,14.94 37.54,14.94 37.49,14.99 37.01,14.99 36.96,14.94 36.86,14.94 36.75,14.82 35.81,14.82 35.72,14.91
  Inner1 w0.254: v3(38.41,14.94) 38.5,15.03 38.76,15.03 39.52,14.28 39.52,13.75 39.06,13.29 35.33,13.29 31.36,9.33 31.01,9.33 30.99,9.31 24.67,9.31 22.33,6.97 16.78,6.97 14.38,4.57 14.38,3.65 v3(14.29,3.55)
  Inner2 w0.305: v3(14.29,3.55) 14.37,3.64
PA2: length 47.2
  Top Layer w0.254: H4.24 13.11,1.99 13.25,2.12 13.25,3.66 v3(13.24,3.67) ; 37.2,14.41 37.19,14.39 35.74,14.39 35.72,14.41
  Top Layer w0.305: R6.1 6.45,7.98 v3(6.45,5.38)
  Inner1 w0.254: v3(37.25,14.4) 38.7,14.4 38.88,14.22 38.88,13.97 38.7,13.79 34.97,13.79 30.85,9.67 24.41,9.67 22.14,7.4 15.22,7.4 13.24,5.42 v3(13.24,3.67)
  Inner2 w0.305: v3(13.24,3.67) 13.24,4.77 12.63,5.38 v3(6.45,5.38)
PA3: length 18
  Top Layer w0.254: H4.16 28.34,2.46 28.34,4.16 29.86,5.68 37.57,5.68 37.75,5.86 主控V1.0.17
PA4: length 17
  Top Layer w0.254: 主控V1.0.18 38.25,5.86 38.1,5.71 38.1,5.71 37.72,5.32 37.71,5.32 37.59,5.2 30.65,5.2 30.3,4.85 30.3,2.5 H4.15
PA5: length 15.3
  Top Layer w0.254: H4.14 32.19,2.61 32.19,4.33 32.57,4.71 37.6,4.71 37.73,4.84 37.74,4.84 38.6,5.71 38.6,5.71 38.75,5.86 主控V1.0.19
PA6: length 13.6
  Top Layer w0.254: H4.13 34.24,2.56 34.24,4.09 34.49,4.34 37.73,4.34 37.75,4.36 37.76,4.36 39.1,5.7 39.1,5.71 39.25,5.86 主控V1.0.20
PA7: length 12
  Top Layer w0.254: 主控V1.0.21 39.75,5.52 38.17,3.95 36.61,3.95 36.24,3.58 36.24,2.56 H4.12
PA8: length 21.6
  Top Layer w0.254: H4.5 50.81,2.15 50.26,2.7 50.26,3.38 52.66,5.78 52.66,16.27 50.96,17.97 47.32,17.97 主控V1.0.42
PA9: length 21.5
  Top Layer w0.254: H4.4 53.42,2.6 53.42,16.1 51.13,18.39 主控V1.0.43
PA10: length 22.3
  Top Layer w0.254: H4.3 54.26,2.54 54.26,3.99 53.78,4.47 53.78,16.25 51.13,18.89 主控V1.0.44
PA11: length 23.6
  Top Layer w0.254: 主控V1.0.45 51.14,19.39 54.14,16.39 54.14,6.04 56.29,3.88 56.29,2.51 H4.2
PA12: length 25
  Top Layer w0.254: 主控V1.0.46 47.28,19.86 51.17,19.86 54.49,16.54 54.49,7.26 58.25,3.5 58.25,2.55 H4.1
PA15: length 25.6
  Top Layer w0.254: v3(44.3,24.25) 44.3,22.95 主控V1.0.51
  Inner2 w0.254: v3(44.3,24.25) 44.3,9.5 43.13,8.32 42.31,8.32 41.09,7.11 v3(41.09,3.95)
  Bottom Layer w0.254: v3(41.09,3.95) 41.09,2.27 H3.16
PB0: length 10.1
  Top Layer w0.254: H4.9 42.27,2.53 42.27,3.98 41.25,5 主控V1.0.24
PB1: length 11.5
  Top Layer w0.254: 主控V1.0.25 41.75,5.47 42.35,4.87 43.76,4.87 44.18,4.45 44.18,2.62 H4.8
PB2: length 12.3
  Top Layer w0.254: 主控V1.0.26 42.25,6.06 43.04,5.27 44.76,5.27 46.24,3.79 46.24,2.56 H4.7
PB3: length 55.2
  Top Layer w0.254: v3(41.79,25.69) 41.75,25.65 41.75,24.78 41.81,24.71 41.81,24.27 41.75,24.2 主控V1.0.56
  Inner2 w0.254: v3(41.79,25.69) 41.75,25.66 41.75,11.37 35.21,4.83 31.82,4.83 31.21,4.22 v3(31.21,3.79)
  Bottom Layer w0.254: v3(41.79,25.69) 42.52,26.42 58.29,26.42 60.91,29.04 60.91,30.47 H6.2 ; v3(31.21,3.79) 31.21,2.39 H3.11
PB4: length 58
  Top Layer w0.254: H6.3 63.3,30.61 63.3,28.65 61.69,27.03 v3(58.07,27.03) ; 主控V1.0.57 41.22,22.93 v3(41.22,24.19) 41.22,26.16 v3(41.57,26.51)
  Inner2 w0.254: v3(41.22,24.19) 41.22,11.59 34.83,5.21 30.81,5.21 v3(29.35,3.75)
  Bottom Layer w0.254: H3.10 29.35,2.53 v3(29.35,3.75) ; v3(58.07,27.03) 42.09,27.03 v3(41.57,26.51)
PB5: length 34.5
  Top Layer w0.254: v3(40.64,25.05) 40.75,24.95 40.75,24.47 40.68,24.41 40.68,23.96 40.75,23.9 主控V1.0.58
  Inner2 w0.254: v3(27.26,3.68) 27.26,4.07 28.9,5.71 34.53,5.71 35.75,6.93 36.02,6.93 36.36,7.28 36.36,7.54 40.65,11.83 40.65,24.67 40.64,24.67 v3(40.64,25.05)
  Bottom Layer w0.254: H3.9 27.26,2.44 v3(27.26,3.68)
PB6: length 37.7
  Top Layer w0.254: v3(39.98,25.27) 39.98,24.89 40.29,24.58 40.29,24.08 40.25,24.03 主控V1.0.59
  Inner2 w0.254: v3(25.19,3.63) 25.19,5.87 27.6,8.28 36.58,8.28 40.28,11.98 40.28,23.81 40.29,23.82 40.29,24.52 40.11,24.7 40.11,25.27 ; v3(39.98,25.27) 40.11,25.27
  Bottom Layer w0.254: v3(25.19,3.63) 25.19,2.37 H3.8
PB9: length 41
  Top Layer w0.254: 主控V1.0.62 38.75,25.34 v3(38.78,25.38)
  Inner2 w0.254: v3(19.2,3.69) 19.2,4.45 24.1,9.35 35.53,9.35 38.78,12.6 38.78,14.56 38.99,14.76 38.99,17.59 38.78,17.8 38.78,24.58 38.75,24.62 38.75,25.06 38.78,25.09 v3(38.78,25.38)
  Bottom Layer w0.254: v3(19.2,3.69) 19.2,2.38 H3.5
PB14: length 20.5
  Top Layer w0.254: v3(49.5,14.86) 48.92,14.86 48.88,14.89
  Top Layer w0.305: 48.88,14.89 主控V1.0.36
  Inner2 w0.254: v3(49.5,14.86) 49.9,14.86 49.92,14.84 50.45,14.84 50.59,14.97 51.94,14.97 53.05,13.87 53.05,12.31 51.71,10.97 51.71,5.47 50.31,4.06 49.47,4.06 v3(49.22,3.82)
  Bottom Layer w0.254: v3(49.22,3.82) 49.22,2.4 H3.20
PB15: length 19.9
  Top Layer w0.254: 48.88,15.39 50.11,15.39 v3(50.14,15.37)
  Top Layer w0.305: 48.88,15.39 主控V1.0.37
  Inner2 w0.254: v3(50.14,15.37) 52.11,15.37 53.45,14.03 53.45,12.14 52.11,10.81 52.11,4.91 51.29,4.08 v3(51.29,3.53)
  Bottom Layer w0.254: H3.21 51.29,2.46 v3(51.29,3.53)
PC0: length 34.4
  Top Layer w0.254: v3(24.23,3.58) 24.23,2.57 H4.18 ; v3(37.88,17.96) 37.5,17.96 37.08,17.54 36.85,17.54 36.78,17.47 35.82,17.47 主控V1.0.8
  Inner1 w0.254: v3(24.23,3.58) 24.23,5.26 25.65,6.68 32.08,6.68 36.21,10.8 39.94,10.8 41.87,12.73 41.87,15.46 39.37,17.96 v3(37.88,17.96)
PC1: length 34.1
  Top Layer w0.254: 主控V1.0.9 35.82,16.97 36.78,16.97 36.92,17.11 37.15,17.11 37.42,17.37 v3(38.45,17.37) ; v3(22.23,3.61) 22.23,2.57 H4.19
  Inner1 w0.254: v3(22.23,3.61) 22.23,3.96 25.44,7.18 31.88,7.18 36,11.3 39.73,11.3 41.37,12.94 41.37,15.26 39.25,17.37 v3(38.45,17.37)
PC2: length 34.9
  Top Layer w0.254: v3(20.29,3.63) 20.29,2.51 H4.20 ; 主控V1.0.10 35.82,16.32 36.78,16.32 37.21,16.75 37.3,16.75 37.35,16.71 v3(37.73,16.71)
  Inner1 w0.254: v3(37.73,16.71) 39.21,16.71 40.87,15.05 40.87,13.15 39.52,11.8 35.79,11.8 31.67,7.68 25.22,7.68 22.89,5.35 21.09,5.35 20.29,4.55 v3(20.29,3.63)
PC3: length 34.9
  Top Layer w0.254: v3(18.22,3.61) 18.21,3.61 18.21,2.59 H4.21 ; 35.72,15.91 36.86,15.91 37.13,16.18 v3(38.36,16.18)
  Inner1 w0.254: v3(38.36,16.18) 39.07,16.18 40.39,14.85 40.39,13.34 39.33,12.28 35.6,12.28 31.47,8.15 25.04,8.15 22.89,6.01 20.61,6.01 v3(18.22,3.61)
PC4: length 9.2
  Top Layer w0.254: 主控V1.0.22 40.25,5.31 38.36,3.43 38.36,3
PC5: length 9.9
  Top Layer w0.254: H4.10 40.15,2.65 40.15,4.4 40.75,5 主控V1.0.23
PC6: length 20.4
  Top Layer w0.254: v3(50.64,15.9) 49.57,15.9 49.5,15.83 49.06,15.83 48.98,15.9 47.26,15.9 主控V1.0.38
  Inner2 w0.254: v3(52.64,3.83) 52.64,10.59 53.98,11.92 53.98,14.25 52.33,15.9 v3(50.64,15.9)
  Bottom Layer w0.254: v3(52.64,3.83) 52.64,2.16 H3.22
PC7: length 22.4
  Top Layer w0.254: 主控V1.0.39 49.25,16.39 v3(49.28,16.36)
  Inner2 w0.254: v3(49.28,16.36) 49.29,16.37 49.54,16.37 49.59,16.32 50.31,16.32 50.42,16.44 50.46,16.44 50.47,16.44 52.55,16.44 54.52,14.48 54.52,11.7 53.19,10.36 53.19,5.47 54.24,4.41 54.82,4.41 55.03,4.2 v3(55.03,3.9)
  Bottom Layer w0.254: v3(55.03,3.9) 55.03,2.2 H3.23
PC8: length 24.1
  Top Layer w0.254: 主控V1.0.40 49.77,16.89 v3(49.81,16.85)
  Inner2 w0.254: v3(49.81,16.85) 50.29,16.85 50.32,16.83 50.76,16.83 50.78,16.85 52.72,16.85 54.93,14.65 54.93,11.53 53.59,10.19 53.59,5.87 54.57,4.9 56.06,4.9 v3(56.92,4.04)
  Bottom Layer w0.254: H3.24 56.92,2.1 v3(56.92,4.04)
PC9: length 25.8
  Top Layer w0.254: v3(50.54,17.36) 50.54,17.37 50.52,17.38 47.26,17.38 主控V1.0.41
  Inner2 w0.254: v3(50.54,17.36) 52.93,17.36 55.44,14.86 55.44,11.32 54.1,9.98 54.1,6.84 55.25,5.69 57.23,5.69 v3(58.88,4.04)
  Bottom Layer w0.254: v3(58.88,4.04) 58.88,2.06 H3.25
PC10: length 27.7
  Top Layer w0.254: v3(43.8,25.09) 43.8,24.78 43.68,24.65 43.68,24.21 43.77,24.12 43.77,22.92 主控V1.0.52
  Inner2 w0.254: v3(39.27,3.5) 39.27,6 42.61,9.33 42.61,9.81 42.95,10.15 43.43,10.15 43.8,10.52 v3(43.8,25.09)
  Bottom Layer w0.254: H3.15 39.27,2.45 v3(39.27,3.5)
PC11: length 28.7
  Top Layer w0.254: 主控V1.0.53 43.26,22.91 43.26,24.91 43.24,24.94 43.24,25.38 43.2,25.41 v3(43.19,25.41)
  Inner2 w0.254: v3(43.19,25.41) 43.19,10.78 42.93,10.51 42.8,10.51 42.25,9.96 42.25,9.84 37.19,4.77 v3(37.19,3.42)
  Bottom Layer w0.254: v3(37.19,3.42) 37.19,2.36 H3.14
PC12: length 27.2
  Top Layer w0.254: 主控V1.0.54 42.73,22.91 v3(42.73,24.41)
  Inner2 w0.254: v3(35.36,3.6) 42.73,10.97 v3(42.73,24.41)
  Bottom Layer w0.254: v3(35.36,3.6) 35.36,2.54 H3.13
PC13: length 34.6
  Top Layer w0.254: 主控V1.0.2 37.82,20.39 v4(37.88,20.45) ; v3(26.26,3.55) 26.26,2.54 H4.17
  Inner1 w0.254: v3(26.26,3.55) 26.26,5.41 27.03,6.19 32.47,6.19 36.56,10.28 40.15,10.28 42.28,12.41 42.28,15.84 37.88,20.25 v4(37.88,20.45)
PD2: length 30.1
  Top Layer w0.254: 主控V1.0.55 42.29,22.94 42.29,24.1 42.18,24.21 42.18,24.65 42.32,24.8 v3(42.32,24.96)
  Inner2 w0.254: v3(42.32,24.96) 42.32,24.76 42.2,24.63 42.2,24.19 42.32,24.06 42.32,11.14 35.56,4.38 33.99,4.38 v3(33.25,3.64)
  Bottom Layer w0.254: v3(33.25,3.64) 33.25,2.43 H3.12
RESET: length 40.1
  Top Layer w0.254: v3(37.32,18.97) 37.34,18.95 37.34,18.53 36.71,17.89 主控V1.0.7 ; 14.02,26.53 14.02,28.67 复位.2 ; 14.02,26.53 13.93,26.62 R1.2 ; 14.02,26.53 C43.2
  Bottom Layer w0.254: 复位.2 15.78,30.32 33.79,30.32 37.34,26.76 37.34,20.23 37.32,20.21 v3(37.32,18.97)
SWCLK: length 12.1
  Top Layer w0.254: v3(47.1,28.5) 47.1,27.31 44.84,25.05 ; 44.84,25.05 44.84,24.03 44.75,23.94 主控V1.0.50 ; 44.84,25.05 v3(44.81,25.02)
  Bottom Layer w0.254: H7.3 50.79,30.56 50.79,28.97 50.32,28.5 v3(47.1,28.5)
SWDIO: length 8.9
  Top Layer w0.254: H7.2 48.22,27.31 v3(45.63,24.72) 45.25,24.33 主控V1.0.49
VREF: length 6.1
  Top Layer w0.305: v2(43.19,9.48) 43.25,9.54 主控V1.0.28
  Bottom Layer w0.305: U5.5 41.81,12.58 C42.2 43.21,9.5 v2(43.19,9.48)
$1N19272: length 2.5
  Top Layer w0.508: LED1.1 19.8,15.84 R2.2
$1N19808: length 2.7
  Top Layer w0.305: LED2.1 4.5,10.58 R6.2

## Copper pours and planes (outline as drawn; the poured copper is in the pictures)
GND on Top Layer: -12.47,34.18 77.27,34.18 77.27,-3.44 -12.47,-3.44
GND on Bottom Layer: -4.54,36.2 81.65,36.2 81.65,-2.17 -4.54,-2.17

Small or netless copper shapes (teardrops, artwork), in the pictures only: 183 on Top Layer, 71 on Bottom Layer, 18 on Inner1, 28 on Inner2

## Text on the board
Bottom Silkscreen Layer: 3.3 | PB9 | PB8 | PB7 | PB6 | PB5 | PB4 | PB3 | PD2 | PC12 | PC11 | PC10 | PB11 | PB12 | PB13 | PB14 | PB15 | PC6 | PC7 | PC8 | PC9 | PA15
Top Silkscreen Layer: GND | PA2 | PA1 | PA0 | PC3 | PC2 | PC1 | PC0 | PC13 | PA3 | PA4 | PA5 | PA6 | PA7 | PC4 | PC5 | PB0 | PB1 | PB2 | PB10 | PA8 | PA9 | PA10 | PA11 | PA12 | 复位 | 5V | CLK | 3V3 | TX | RX | DIO | 主控V2.0
